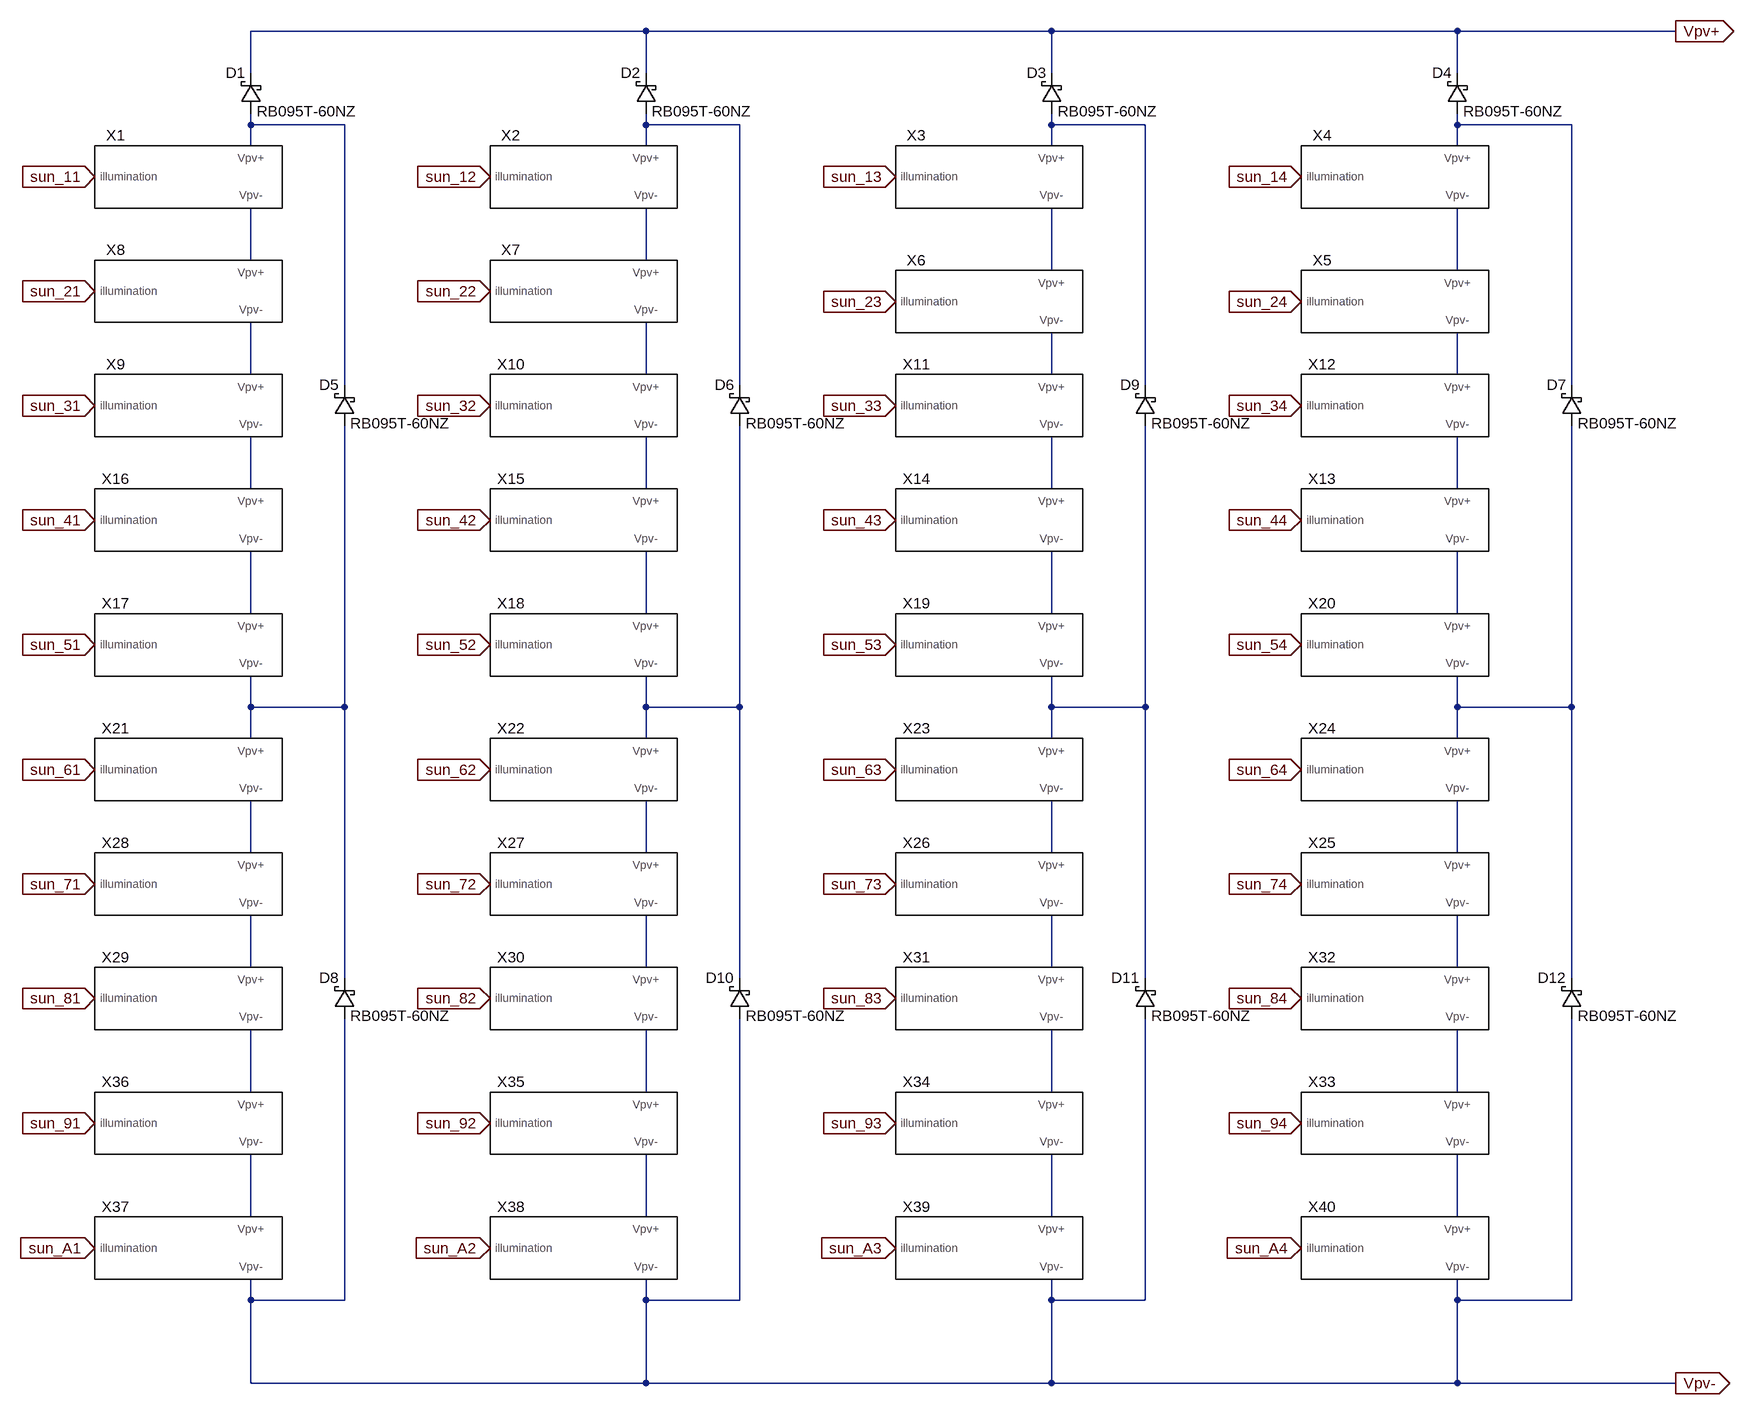
[diagram p0: schematic pannello_40Celle_v1-all.asc]
pannello_40Celle_v1-all.asc, the LTspice schematic file:
Version 4
SHEET 1 1976 1992
WIRE 272 -160 -336 -160
WIRE 896 -160 272 -160
WIRE 1520 -160 896 -160
WIRE 1856 -160 1520 -160
WIRE -336 -96 -336 -160
WIRE 272 -96 272 -160
WIRE 896 -96 896 -160
WIRE 1520 -96 1520 -160
WIRE -336 -16 -336 -32
WIRE -192 -16 -336 -16
WIRE 272 -16 272 -32
WIRE 416 -16 272 -16
WIRE 896 -16 896 -32
WIRE 1040 -16 896 -16
WIRE 1520 -16 1520 -32
WIRE 1696 -16 1520 -16
WIRE -336 16 -336 -16
WIRE 272 16 272 -16
WIRE 896 16 896 -16
WIRE 1520 16 1520 -16
WIRE -336 192 -336 112
WIRE 272 192 272 112
WIRE 896 208 896 112
WIRE 1520 208 1520 112
WIRE -336 368 -336 288
WIRE 272 368 272 288
WIRE 896 368 896 304
WIRE 1520 368 1520 304
WIRE -192 384 -192 -16
WIRE 416 384 416 -16
WIRE 1040 384 1040 -16
WIRE 1696 384 1696 -16
WIRE -336 544 -336 464
WIRE 272 544 272 464
WIRE 896 544 896 464
WIRE 1520 544 1520 464
WIRE -336 736 -336 640
WIRE 272 736 272 640
WIRE 896 736 896 640
WIRE 1520 736 1520 640
WIRE -336 880 -336 832
WIRE -192 880 -192 448
WIRE -192 880 -336 880
WIRE 272 880 272 832
WIRE 416 880 416 448
WIRE 416 880 272 880
WIRE 896 880 896 832
WIRE 1040 880 1040 448
WIRE 1040 880 896 880
WIRE 1520 880 1520 832
WIRE 1696 880 1696 448
WIRE 1696 880 1520 880
WIRE -336 928 -336 880
WIRE 272 928 272 880
WIRE 896 928 896 880
WIRE 1520 928 1520 880
WIRE -336 1104 -336 1024
WIRE 272 1104 272 1024
WIRE 896 1104 896 1024
WIRE 1520 1104 1520 1024
WIRE -336 1280 -336 1200
WIRE 272 1280 272 1200
WIRE 896 1280 896 1200
WIRE 1520 1280 1520 1200
WIRE -192 1296 -192 880
WIRE 416 1296 416 880
WIRE 1040 1296 1040 880
WIRE 1696 1296 1696 880
WIRE -336 1472 -336 1376
WIRE 272 1472 272 1376
WIRE 896 1472 896 1376
WIRE 1520 1472 1520 1376
WIRE -336 1664 -336 1568
WIRE 272 1664 272 1568
WIRE 896 1664 896 1568
WIRE 1520 1664 1520 1568
WIRE -336 1792 -336 1760
WIRE -192 1792 -192 1360
WIRE -192 1792 -336 1792
WIRE 272 1792 272 1760
WIRE 416 1792 416 1360
WIRE 416 1792 272 1792
WIRE 896 1792 896 1760
WIRE 1040 1792 1040 1360
WIRE 1040 1792 896 1792
WIRE 1520 1792 1520 1760
WIRE 1696 1792 1696 1360
WIRE 1696 1792 1520 1792
WIRE -336 1920 -336 1792
WIRE 272 1920 272 1792
WIRE 272 1920 -336 1920
WIRE 896 1920 896 1792
WIRE 896 1920 272 1920
WIRE 1520 1920 1520 1792
WIRE 1520 1920 896 1920
WIRE 1856 1920 1520 1920
FLAG 1856 -160 Vpv+
IOPIN 1856 -160 Out
FLAG 1856 1920 Vpv-
IOPIN 1856 1920 Out
FLAG -576 64 sun_11
IOPIN -576 64 In
FLAG -576 240 sun_21
IOPIN -576 240 In
FLAG 32 64 sun_12
IOPIN 32 64 In
FLAG 32 240 sun_22
IOPIN 32 240 In
FLAG 656 64 sun_13
IOPIN 656 64 In
FLAG 656 256 sun_23
IOPIN 656 256 In
FLAG 1280 256 sun_24
IOPIN 1280 256 In
FLAG 1280 64 sun_14
IOPIN 1280 64 In
FLAG -576 976 sun_61
IOPIN -576 976 In
FLAG -576 416 sun_31
IOPIN -576 416 In
FLAG -576 592 sun_41
IOPIN -576 592 In
FLAG -576 784 sun_51
IOPIN -576 784 In
FLAG 32 784 sun_52
IOPIN 32 784 In
FLAG 32 976 sun_62
IOPIN 32 976 In
FLAG 32 416 sun_32
IOPIN 32 416 In
FLAG 32 592 sun_42
IOPIN 32 592 In
FLAG 656 976 sun_63
IOPIN 656 976 In
FLAG 656 416 sun_33
IOPIN 656 416 In
FLAG 656 592 sun_43
IOPIN 656 592 In
FLAG 656 784 sun_53
IOPIN 656 784 In
FLAG 1280 976 sun_64
IOPIN 1280 976 In
FLAG 1280 416 sun_34
IOPIN 1280 416 In
FLAG 1280 592 sun_44
IOPIN 1280 592 In
FLAG 1280 784 sun_54
IOPIN 1280 784 In
FLAG 1280 1152 sun_74
IOPIN 1280 1152 In
FLAG 656 1152 sun_73
IOPIN 656 1152 In
FLAG 32 1152 sun_72
IOPIN 32 1152 In
FLAG -576 1152 sun_71
IOPIN -576 1152 In
FLAG -576 1328 sun_81
IOPIN -576 1328 In
FLAG -576 1520 sun_91
IOPIN -576 1520 In
FLAG 32 1520 sun_92
IOPIN 32 1520 In
FLAG 32 1328 sun_82
IOPIN 32 1328 In
FLAG 656 1328 sun_83
IOPIN 656 1328 In
FLAG 656 1520 sun_93
IOPIN 656 1520 In
FLAG 1280 1328 sun_84
IOPIN 1280 1328 In
FLAG 1280 1520 sun_94
IOPIN 1280 1520 In
FLAG 1280 1712 sun_A4
IOPIN 1280 1712 In
FLAG 656 1712 sun_A3
IOPIN 656 1712 In
FLAG 32 1712 sun_A2
IOPIN 32 1712 In
FLAG -576 1712 sun_A1
IOPIN -576 1712 In
SYMBOL CellaFotovoltaica -400 64 R0
SYMATTR InstName X1
SYMBOL CellaFotovoltaica 208 64 R0
SYMATTR InstName X2
SYMBOL CellaFotovoltaica 832 64 R0
SYMATTR InstName X3
SYMBOL CellaFotovoltaica 1456 64 R0
SYMATTR InstName X4
SYMBOL CellaFotovoltaica 1456 256 R0
SYMATTR InstName X5
SYMBOL CellaFotovoltaica 832 256 R0
SYMATTR InstName X6
SYMBOL CellaFotovoltaica 208 240 R0
SYMATTR InstName X7
SYMBOL CellaFotovoltaica -400 240 R0
SYMATTR InstName X8
SYMBOL CellaFotovoltaica -400 416 R0
SYMATTR InstName X9
SYMBOL CellaFotovoltaica 208 416 R0
SYMATTR InstName X10
SYMBOL CellaFotovoltaica 832 416 R0
SYMATTR InstName X11
SYMBOL CellaFotovoltaica 1456 416 R0
SYMATTR InstName X12
SYMBOL CellaFotovoltaica 1456 592 R0
SYMATTR InstName X13
SYMBOL CellaFotovoltaica 832 592 R0
SYMATTR InstName X14
SYMBOL CellaFotovoltaica 208 592 R0
SYMATTR InstName X15
SYMBOL CellaFotovoltaica -400 592 R0
SYMATTR InstName X16
SYMBOL CellaFotovoltaica -400 784 R0
SYMATTR InstName X17
SYMBOL CellaFotovoltaica 208 784 R0
SYMATTR InstName X18
SYMBOL CellaFotovoltaica 832 784 R0
SYMATTR InstName X19
SYMBOL CellaFotovoltaica 1456 784 R0
SYMATTR InstName X20
SYMBOL CellaFotovoltaica -400 976 R0
SYMATTR InstName X21
SYMBOL CellaFotovoltaica 208 976 R0
SYMATTR InstName X22
SYMBOL CellaFotovoltaica 832 976 R0
SYMATTR InstName X23
SYMBOL CellaFotovoltaica 1456 976 R0
SYMATTR InstName X24
SYMBOL CellaFotovoltaica 1456 1152 R0
SYMATTR InstName X25
SYMBOL CellaFotovoltaica 832 1152 R0
SYMATTR InstName X26
SYMBOL CellaFotovoltaica 208 1152 R0
SYMATTR InstName X27
SYMBOL CellaFotovoltaica -400 1152 R0
SYMATTR InstName X28
SYMBOL CellaFotovoltaica -400 1328 R0
SYMATTR InstName X29
SYMBOL CellaFotovoltaica 208 1328 R0
SYMATTR InstName X30
SYMBOL CellaFotovoltaica 832 1328 R0
SYMATTR InstName X31
SYMBOL CellaFotovoltaica 1456 1328 R0
SYMATTR InstName X32
SYMBOL CellaFotovoltaica 1456 1520 R0
SYMATTR InstName X33
SYMBOL CellaFotovoltaica 832 1520 R0
SYMATTR InstName X34
SYMBOL CellaFotovoltaica 208 1520 R0
SYMATTR InstName X35
SYMBOL CellaFotovoltaica -400 1520 R0
SYMATTR InstName X36
SYMBOL CellaFotovoltaica -400 1712 R0
SYMATTR InstName X37
SYMBOL CellaFotovoltaica 208 1712 R0
SYMATTR InstName X38
SYMBOL CellaFotovoltaica 832 1712 R0
SYMATTR InstName X39
SYMBOL CellaFotovoltaica 1456 1712 R0
SYMATTR InstName X40
SYMBOL schottky 1056 448 R180
WINDOW 0 24 64 Left 2
WINDOW 3 -149 5 Left 2
SYMATTR InstName D9
SYMATTR Value RB095T-60NZ
SYMATTR Description Diode
SYMATTR Type diode
SYMBOL schottky -320 -32 R180
WINDOW 0 24 64 Left 2
WINDOW 3 -149 5 Left 2
SYMATTR InstName D1
SYMATTR Value RB095T-60NZ
SYMATTR Description Diode
SYMATTR Type diode
SYMBOL schottky 288 -32 R180
WINDOW 0 24 64 Left 2
WINDOW 3 -149 5 Left 2
SYMATTR InstName D2
SYMATTR Value RB095T-60NZ
SYMATTR Description Diode
SYMATTR Type diode
SYMBOL schottky 912 -32 R180
WINDOW 0 24 64 Left 2
WINDOW 3 -149 5 Left 2
SYMATTR InstName D3
SYMATTR Value RB095T-60NZ
SYMATTR Description Diode
SYMATTR Type diode
SYMBOL schottky 1536 -32 R180
WINDOW 0 24 64 Left 2
WINDOW 3 -149 5 Left 2
SYMATTR InstName D4
SYMATTR Value RB095T-60NZ
SYMATTR Description Diode
SYMATTR Type diode
SYMBOL schottky -176 448 R180
WINDOW 0 24 64 Left 2
WINDOW 3 -149 5 Left 2
SYMATTR InstName D5
SYMATTR Value RB095T-60NZ
SYMATTR Description Diode
SYMATTR Type diode
SYMBOL schottky 432 448 R180
WINDOW 0 24 64 Left 2
WINDOW 3 -149 5 Left 2
SYMATTR InstName D6
SYMATTR Value RB095T-60NZ
SYMATTR Description Diode
SYMATTR Type diode
SYMBOL schottky 1712 448 R180
WINDOW 0 24 64 Left 2
WINDOW 3 -149 5 Left 2
SYMATTR InstName D7
SYMATTR Value RB095T-60NZ
SYMATTR Description Diode
SYMATTR Type diode
SYMBOL schottky -176 1360 R180
WINDOW 0 24 64 Left 2
WINDOW 3 -149 5 Left 2
SYMATTR InstName D8
SYMATTR Value RB095T-60NZ
SYMATTR Description Diode
SYMATTR Type diode
SYMBOL schottky 432 1360 R180
WINDOW 0 24 64 Left 2
WINDOW 3 -149 5 Left 2
SYMATTR InstName D10
SYMATTR Value RB095T-60NZ
SYMATTR Description Diode
SYMATTR Type diode
SYMBOL schottky 1056 1360 R180
WINDOW 0 24 64 Left 2
WINDOW 3 -149 5 Left 2
SYMATTR InstName D11
SYMATTR Value RB095T-60NZ
SYMATTR Description Diode
SYMATTR Type diode
SYMBOL schottky 1712 1360 R180
WINDOW 0 24 64 Left 2
WINDOW 3 -149 5 Left 2
SYMATTR InstName D12
SYMATTR Value RB095T-60NZ
SYMATTR Description Diode
SYMATTR Type diode

The netlist it stands for:
* pannello_40Celle_v1-all.asc
XX1 sun_11 N001 N005 CellaFotovoltaica  ; pins illumination Vpv+ Vpv-
XX2 sun_12 N002 N006 CellaFotovoltaica  ; pins illumination Vpv+ Vpv-
XX3 sun_13 N003 N007 CellaFotovoltaica  ; pins illumination Vpv+ Vpv-
XX4 sun_14 N004 N008 CellaFotovoltaica  ; pins illumination Vpv+ Vpv-
XX5 sun_24 N008 N012 CellaFotovoltaica  ; pins illumination Vpv+ Vpv-
XX6 sun_23 N007 N011 CellaFotovoltaica  ; pins illumination Vpv+ Vpv-
XX7 sun_22 N006 N010 CellaFotovoltaica  ; pins illumination Vpv+ Vpv-
XX8 sun_21 N005 N009 CellaFotovoltaica  ; pins illumination Vpv+ Vpv-
XX9 sun_31 N009 N013 CellaFotovoltaica  ; pins illumination Vpv+ Vpv-
XX10 sun_32 N010 N014 CellaFotovoltaica  ; pins illumination Vpv+ Vpv-
XX11 sun_33 N011 N015 CellaFotovoltaica  ; pins illumination Vpv+ Vpv-
XX12 sun_34 N012 N016 CellaFotovoltaica  ; pins illumination Vpv+ Vpv-
XX13 sun_44 N016 N020 CellaFotovoltaica  ; pins illumination Vpv+ Vpv-
XX14 sun_43 N015 N019 CellaFotovoltaica  ; pins illumination Vpv+ Vpv-
XX15 sun_42 N014 N018 CellaFotovoltaica  ; pins illumination Vpv+ Vpv-
XX16 sun_41 N013 N017 CellaFotovoltaica  ; pins illumination Vpv+ Vpv-
XX17 sun_51 N017 N021 CellaFotovoltaica  ; pins illumination Vpv+ Vpv-
XX18 sun_52 N018 N022 CellaFotovoltaica  ; pins illumination Vpv+ Vpv-
XX19 sun_53 N019 N023 CellaFotovoltaica  ; pins illumination Vpv+ Vpv-
XX20 sun_54 N020 N024 CellaFotovoltaica  ; pins illumination Vpv+ Vpv-
XX21 sun_61 N021 N025 CellaFotovoltaica  ; pins illumination Vpv+ Vpv-
XX22 sun_62 N022 N026 CellaFotovoltaica  ; pins illumination Vpv+ Vpv-
XX23 sun_63 N023 N027 CellaFotovoltaica  ; pins illumination Vpv+ Vpv-
XX24 sun_64 N024 N028 CellaFotovoltaica  ; pins illumination Vpv+ Vpv-
XX25 sun_74 N028 N032 CellaFotovoltaica  ; pins illumination Vpv+ Vpv-
XX26 sun_73 N027 N031 CellaFotovoltaica  ; pins illumination Vpv+ Vpv-
XX27 sun_72 N026 N030 CellaFotovoltaica  ; pins illumination Vpv+ Vpv-
XX28 sun_71 N025 N029 CellaFotovoltaica  ; pins illumination Vpv+ Vpv-
XX29 sun_81 N029 N033 CellaFotovoltaica  ; pins illumination Vpv+ Vpv-
XX30 sun_82 N030 N034 CellaFotovoltaica  ; pins illumination Vpv+ Vpv-
XX31 sun_83 N031 N035 CellaFotovoltaica  ; pins illumination Vpv+ Vpv-
XX32 sun_84 N032 N036 CellaFotovoltaica  ; pins illumination Vpv+ Vpv-
XX33 sun_94 N036 N040 CellaFotovoltaica  ; pins illumination Vpv+ Vpv-
XX34 sun_93 N035 N039 CellaFotovoltaica  ; pins illumination Vpv+ Vpv-
XX35 sun_92 N034 N038 CellaFotovoltaica  ; pins illumination Vpv+ Vpv-
XX36 sun_91 N033 N037 CellaFotovoltaica  ; pins illumination Vpv+ Vpv-
XX37 sun_A1 N037 Vpv- CellaFotovoltaica  ; pins illumination Vpv+ Vpv-
XX38 sun_A2 N038 Vpv- CellaFotovoltaica  ; pins illumination Vpv+ Vpv-
XX39 sun_A3 N039 Vpv- CellaFotovoltaica  ; pins illumination Vpv+ Vpv-
XX40 sun_A4 N040 Vpv- CellaFotovoltaica  ; pins illumination Vpv+ Vpv-
D9 N023 N003 RB095T-60NZ
D1 N001 Vpv+ RB095T-60NZ
D2 N002 Vpv+ RB095T-60NZ
D3 N003 Vpv+ RB095T-60NZ
D4 N004 Vpv+ RB095T-60NZ
D5 N021 N001 RB095T-60NZ
D6 N022 N002 RB095T-60NZ
D7 N024 N004 RB095T-60NZ
D8 Vpv- N021 RB095T-60NZ
D10 Vpv- N022 RB095T-60NZ
D11 Vpv- N023 RB095T-60NZ
D12 Vpv- N024 RB095T-60NZ
.model D D
.lib standard.dio
.backanno
.end